# EAGLE design recepteur (EAGLE 6.5.0)
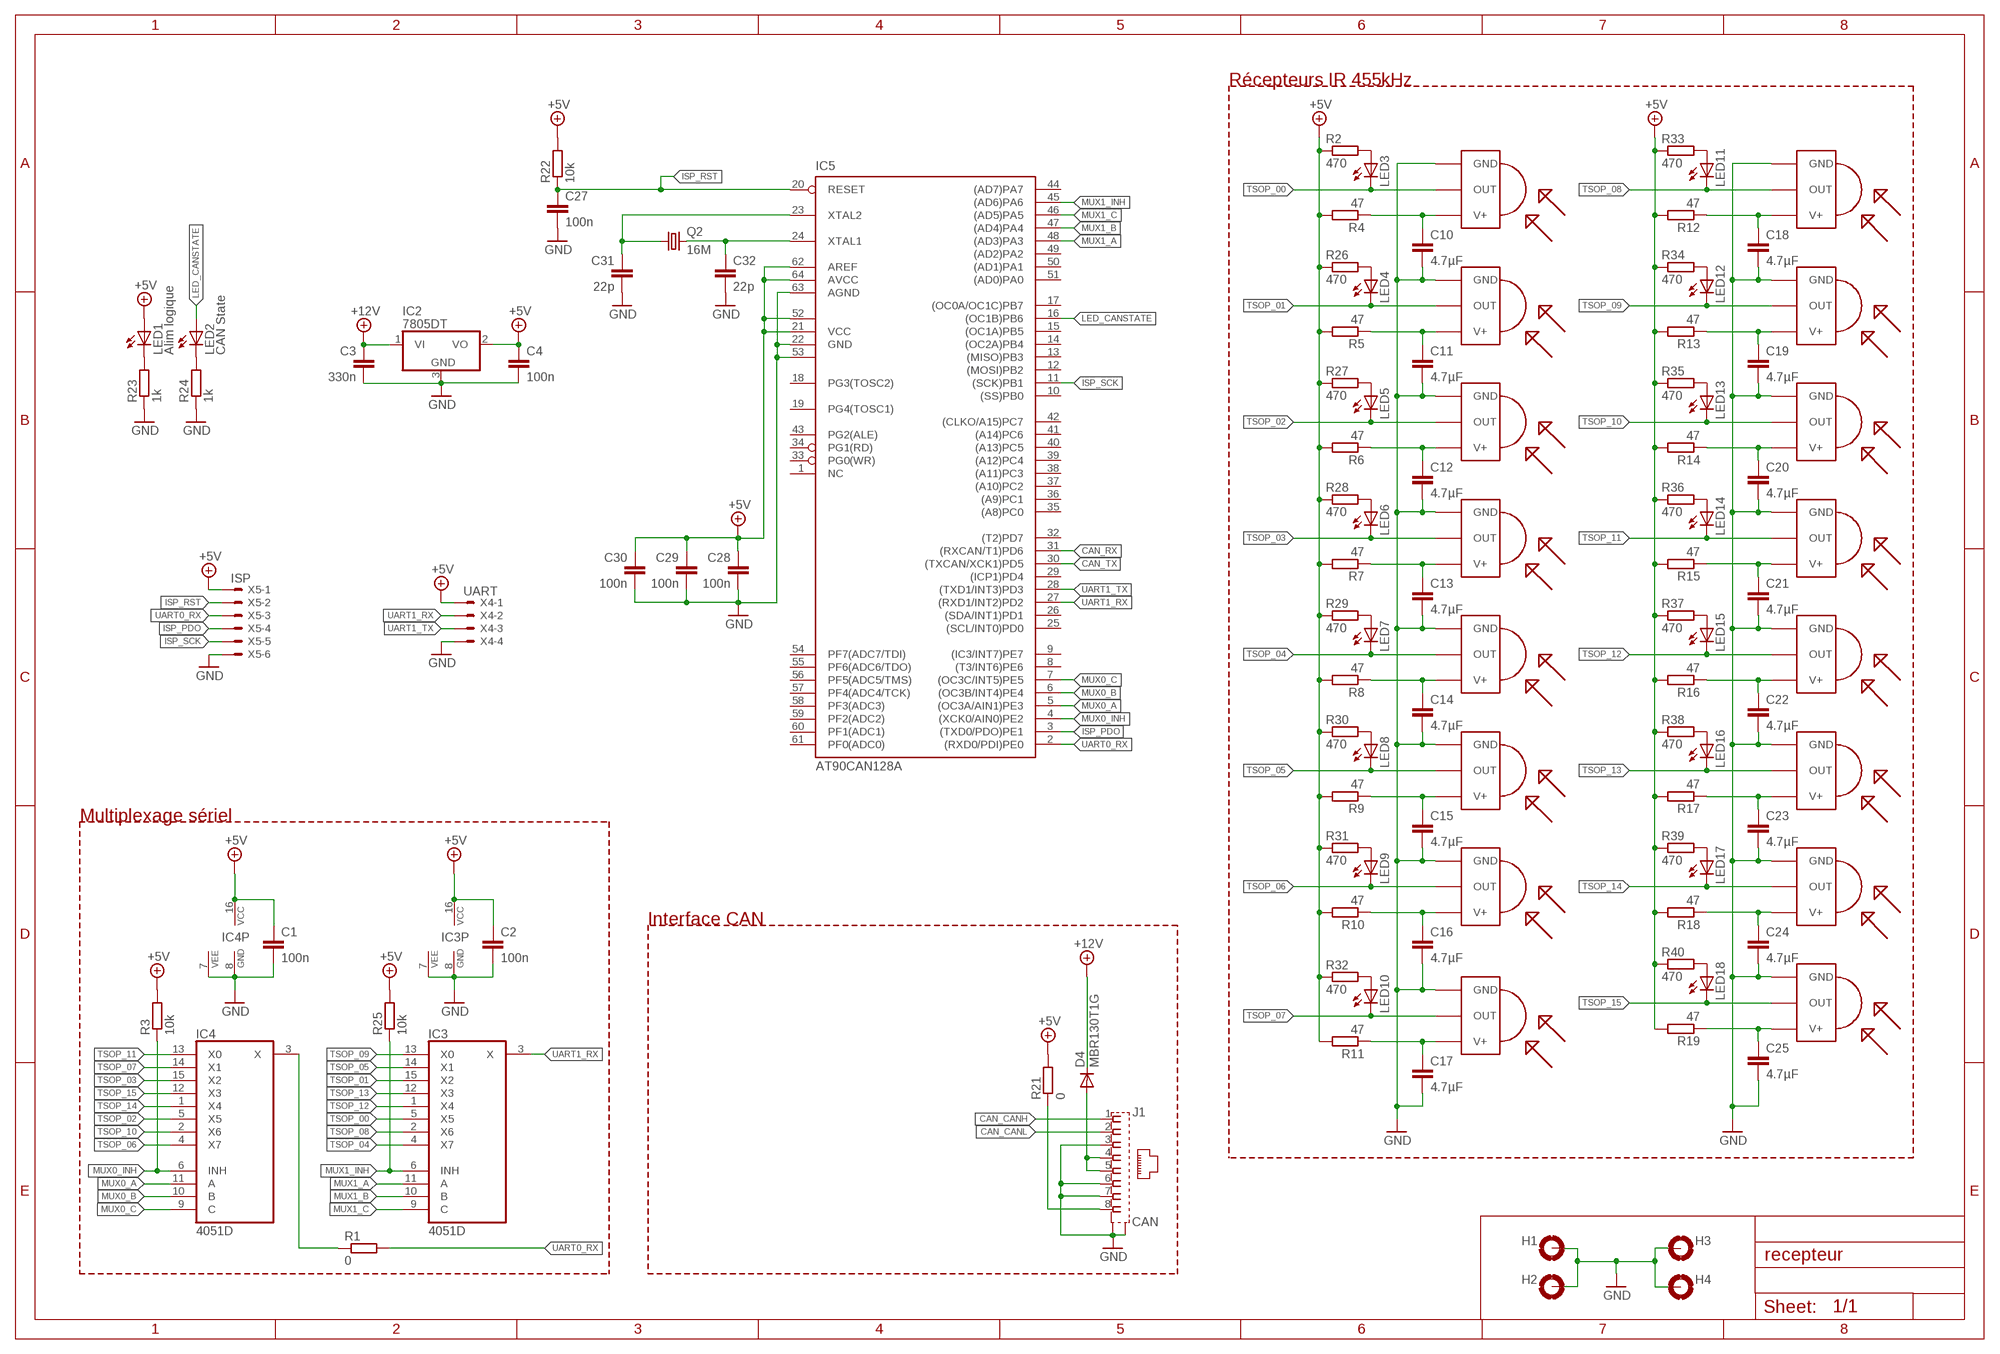
[diagram p0: schematic, sheet 1]

## Parts
C1  100n  C-EUC0805  [C0805]
C2  100n  C-EUC0805  [C0805]
C3  330n  C-EUC0805  [C0805]
C4  100n  C-EUC0805  [C0805]
C10  4.7µF  C-EUC0805  [C0805]
C11  4.7µF  C-EUC0805  [C0805]
C12  4.7µF  C-EUC0805  [C0805]
C13  4.7µF  C-EUC0805  [C0805]
C14  4.7µF  C-EUC0805  [C0805]
C15  4.7µF  C-EUC0805  [C0805]
C16  4.7µF  C-EUC0805  [C0805]
C17  4.7µF  C-EUC0805  [C0805]
C18  4.7µF  C-EUC0805  [C0805]
C19  4.7µF  C-EUC0805  [C0805]
C20  4.7µF  C-EUC0805  [C0805]
C21  4.7µF  C-EUC0805  [C0805]
C22  4.7µF  C-EUC0805  [C0805]
C23  4.7µF  C-EUC0805  [C0805]
C24  4.7µF  C-EUC0805  [C0805]
C25  4.7µF  C-EUC0805  [C0805]
C27  100n  C-EUC0805  [C0805]
C28  100n  C-EUC0805  [C0805]
C29  100n  C-EUC0805  [C0805]
C30  100n  C-EUC0805  [C0805]
C31  22p  C-EUC0805  [C0805]
C32  22p  C-EUC0805  [C0805]
D4  MBR130T1G  DIODE-SOD123  [SOD123]
H1  MOUNT-PAD-ROUND3.0  [3,0-PAD]
H2  MOUNT-PAD-ROUND3.0  [3,0-PAD]
H3  MOUNT-PAD-ROUND3.0  [3,0-PAD]
H4  MOUNT-PAD-ROUND3.0  [3,0-PAD]
IC2  7805DT  [TO252]
IC3  4051D  [SO16]
IC4  4051D  [SO16]
IC5  AT90CAN128A  [TQFP64]
J1  CAN  557969-1  [557969-1]
LED1  Alim logique  LEDCHIP-LED0805  [CHIP-LED0805]
LED2  CAN State  LEDCHIP-LED0805  [CHIP-LED0805]
LED3  LEDCHIP-LED0805  [CHIP-LED0805]
LED4  LEDCHIP-LED0805  [CHIP-LED0805]
LED5  LEDCHIP-LED0805  [CHIP-LED0805]
LED6  LEDCHIP-LED0805  [CHIP-LED0805]
LED7  LEDCHIP-LED0805  [CHIP-LED0805]
LED8  LEDCHIP-LED0805  [CHIP-LED0805]
LED9  LEDCHIP-LED0805  [CHIP-LED0805]
LED10  LEDCHIP-LED0805  [CHIP-LED0805]
LED11  LEDCHIP-LED0805  [CHIP-LED0805]
LED12  LEDCHIP-LED0805  [CHIP-LED0805]
LED13  LEDCHIP-LED0805  [CHIP-LED0805]
LED14  LEDCHIP-LED0805  [CHIP-LED0805]
LED15  LEDCHIP-LED0805  [CHIP-LED0805]
LED16  LEDCHIP-LED0805  [CHIP-LED0805]
LED17  LEDCHIP-LED0805  [CHIP-LED0805]
LED18  LEDCHIP-LED0805  [CHIP-LED0805]
Q2  16M  CRYSTALHC49UP  [HC49UP]
R1  0  R-EU_R0805  [R0805]
R2  470  R-EU_R0805  [R0805]
R3  10k  R-EU_R0805  [R0805]
R4  47  R-EU_R0805  [R0805]
R5  47  R-EU_R0805  [R0805]
R6  47  R-EU_R0805  [R0805]
R7  47  R-EU_R0805  [R0805]
R8  47  R-EU_R0805  [R0805]
R9  47  R-EU_R0805  [R0805]
R10  47  R-EU_R0805  [R0805]
R11  47  R-EU_R0805  [R0805]
R12  47  R-EU_R0805  [R0805]
R13  47  R-EU_R0805  [R0805]
R14  47  R-EU_R0805  [R0805]
R15  47  R-EU_R0805  [R0805]
R16  47  R-EU_R0805  [R0805]
R17  47  R-EU_R0805  [R0805]
R18  47  R-EU_R0805  [R0805]
R19  47  R-EU_R0805  [R0805]
R21  0  R-EU_M0805  [M0805]
R22  10k  R-EU_R0805  [R0805]
R23  1k  R-EU_M0805  [M0805]
R24  1k  R-EU_M0805  [M0805]
R25  10k  R-EU_R0805  [R0805]
R26  470  R-EU_R0805  [R0805]
R27  470  R-EU_R0805  [R0805]
R28  470  R-EU_R0805  [R0805]
R29  470  R-EU_R0805  [R0805]
R30  470  R-EU_R0805  [R0805]
R31  470  R-EU_R0805  [R0805]
R32  470  R-EU_R0805  [R0805]
R33  470  R-EU_R0805  [R0805]
R34  470  R-EU_R0805  [R0805]
R35  470  R-EU_R0805  [R0805]
R36  470  R-EU_R0805  [R0805]
R37  470  R-EU_R0805  [R0805]
R38  470  R-EU_R0805  [R0805]
R39  470  R-EU_R0805  [R0805]
R40  470  R-EU_R0805  [R0805]
TSOP00  TSOP7000  TSOP1830  [TSOP18XX]
TSOP01  TSOP7000  TSOP1830  [TSOP18XX]
TSOP02  TSOP7000  TSOP1830  [TSOP18XX]
TSOP03  TSOP7000  TSOP1830  [TSOP18XX]
TSOP04  TSOP7000  TSOP1830  [TSOP18XX]
TSOP05  TSOP7000  TSOP1830  [TSOP18XX]
TSOP06  TSOP7000  TSOP1830  [TSOP18XX]
TSOP07  TSOP7000  TSOP1830  [TSOP18XX]
TSOP08  TSOP7000  TSOP1830  [TSOP18XX]
TSOP09  TSOP7000  TSOP1830  [TSOP18XX]
TSOP10  TSOP7000  TSOP1830  [TSOP18XX]
TSOP11  TSOP7000  TSOP1830  [TSOP18XX]
TSOP12  TSOP7000  TSOP1830  [TSOP18XX]
TSOP13  TSOP7000  TSOP1830  [TSOP18XX]
TSOP14  TSOP7000  TSOP1830  [TSOP18XX]
TSOP15  TSOP7000  TSOP1830  [TSOP18XX]
X4  UART  53261-04  [53261-04]
X5  ISP  53261-06  [53261-06]

## Nets
+5V: C1.1 C2.1 C4.1 C28.1 C29.1 C30.1 IC2.2(VO) IC3.16(VCC) IC4.16(VCC) IC5.21(VCC) IC5.52(VCC1) IC5.62(AREF) IC5.64(AVCC) LED1.A R2.1 R3.2 R4.2 R5.2 R6.2 R7.2 R8.2 R9.2 R10.2 R11.2 R12.2 R13.2 R14.2 R15.2 R16.2 R17.2 R18.2 R19.2 R21.2 R22.2 R25.2 R26.1 R27.1 R28.1 R29.1 R30.1 R31.1 R32.1 R33.1 R34.1 R35.1 R36.1 R37.1 R38.1 R39.1 R40.1 X4.1 X5.1
+12V: C3.1 D4.C IC2.1(VI)
CAN_CANH: J1.1
CAN_CANL: J1.2
CAN_RX: IC5.31((RXCAN/T1)PD6)
CAN_TX: IC5.30((TXCAN/XCK1)PD5)
GND: C1.2 C2.2 C3.2 C4.2 C10.2 C11.2 C12.2 C13.2 C14.2 C15.2 C16.2 C17.2 C18.2 C19.2 C20.2 C21.2 C22.2 C23.2 C24.2 C25.2 C27.2 C28.2 C29.2 C30.2 C31.2 C32.2 H1.B3,0(MOUNT) H2.B3,0(MOUNT) H3.B3,0(MOUNT) H4.B3,0(MOUNT) IC2.3(GND) IC3.7(VEE) IC3.8(GND) IC4.7(VEE) IC4.8(GND) IC5.22(GND) IC5.53(GND1) IC5.63(AGND) J1.3 J1.6 J1.7 J1.G1(S2) J1.G2(S1) R23.1 R24.1 TSOP00.GND TSOP01.GND TSOP02.GND TSOP03.GND TSOP04.GND TSOP05.GND TSOP06.GND TSOP07.GND TSOP08.GND TSOP09.GND TSOP10.GND TSOP11.GND TSOP12.GND TSOP13.GND TSOP14.GND TSOP15.GND X4.4 X5.6
ISP_PDO: IC5.3((TXD0/PDO)PE1) X5.4
ISP_RST: C27.1 IC5.20(RESET) R22.1 X5.2
ISP_SCK: IC5.11((SCK)PB1) X5.5
LED_CANSTATE: IC5.16((OC1B)PB6) LED2.A
MUX0_A: IC4.11(A) IC5.5((OC3A/AIN1)PE3)
MUX0_B: IC4.10(B) IC5.6((OC3B/INT4)PE4)
MUX0_C: IC4.9(C) IC5.7((OC3C/INT5)PE5)
MUX0_INH: IC4.6(INH) IC5.4((XCK0/AIN0)PE2) R3.1
MUX1_A: IC3.11(A) IC5.48((AD3)PA3)
MUX1_B: IC3.10(B) IC5.47((AD4)PA4)
MUX1_C: IC3.9(C) IC5.46((AD5)PA5)
MUX1_INH: IC3.6(INH) IC5.45((AD6)PA6) R25.1
N$1: IC4.3(X) R1.1
N$2: LED3.A R2.2
N$3: LED4.A R26.2
N$4: LED5.A R27.2
N$6: LED6.A R28.2
N$7: LED7.A R29.2
N$8: J1.8 R21.1
N$9: C10.1 R4.1 TSOP00.VCC(V+)
N$10: C11.1 R5.1 TSOP01.VCC(V+)
N$11: C12.1 R6.1 TSOP02.VCC(V+)
N$12: C13.1 R7.1 TSOP03.VCC(V+)
N$13: C32.1 IC5.24(XTAL1) Q2.2
N$14: C31.1 IC5.23(XTAL2) Q2.1
N$15: LED1.C R23.2
N$16: LED8.A R30.2
N$17: LED2.C R24.2
N$18: LED9.A R31.2
N$19: LED10.A R32.2
N$20: LED11.A R33.2
N$21: C14.1 R8.1 TSOP04.VCC(V+)
N$22: C15.1 R9.1 TSOP05.VCC(V+)
N$23: C16.1 R10.1 TSOP06.VCC(V+)
N$24: LED12.A R34.2
N$26: LED13.A R35.2
N$27: LED14.A R36.2
N$28: LED15.A R37.2
N$29: LED16.A R38.2
N$30: LED17.A R39.2
N$31: LED18.A R40.2
N$32: C17.1 R11.1 TSOP07.VCC(V+)
N$33: C25.1 R19.1 TSOP15.VCC(V+)
N$34: D4.A J1.4 J1.5
N$35: C24.1 R18.1 TSOP14.VCC(V+)
N$36: C23.1 R17.1 TSOP13.VCC(V+)
N$37: C22.1 R16.1 TSOP12.VCC(V+)
N$38: C21.1 R15.1 TSOP11.VCC(V+)
N$39: C19.1 R13.1 TSOP09.VCC(V+)
N$40: C20.1 R14.1 TSOP10.VCC(V+)
N$41: C18.1 R12.1 TSOP08.VCC(V+)
TSOP_00: IC3.5(X5) LED3.C TSOP00.OUT
TSOP_01: IC3.15(X2) LED4.C TSOP01.OUT
TSOP_02: IC4.5(X5) LED5.C TSOP02.OUT
TSOP_03: IC4.15(X2) LED6.C TSOP03.OUT
TSOP_04: IC3.4(X7) LED7.C TSOP04.OUT
TSOP_05: IC3.14(X1) LED8.C TSOP05.OUT
TSOP_06: IC4.4(X7) LED9.C TSOP06.OUT
TSOP_07: IC4.14(X1) LED10.C TSOP07.OUT
TSOP_08: IC3.2(X6) LED11.C TSOP08.OUT
TSOP_09: IC3.13(X0) LED12.C TSOP09.OUT
TSOP_10: IC4.2(X6) LED13.C TSOP10.OUT
TSOP_11: IC4.13(X0) LED14.C TSOP11.OUT
TSOP_12: IC3.1(X4) LED15.C TSOP12.OUT
TSOP_13: IC3.12(X3) LED16.C TSOP13.OUT
TSOP_14: IC4.1(X4) LED17.C TSOP14.OUT
TSOP_15: IC4.12(X3) LED18.C TSOP15.OUT
UART0_RX: IC5.2((RXD0/PDI)PE0) R1.2 X5.3
UART1_RX: IC3.3(X) IC5.27((RXD1/INT2)PD2) X4.2
UART1_TX: IC5.28((TXD1/INT3)PD3) X4.3
Unconnected: IC5.1(NC) IC5.8((T3/INT6)PE6) IC5.9((IC3/INT7)PE7) IC5.10((SS)PB0) IC5.12((MOSI)PB2) IC5.13((MISO)PB3) IC5.14((OC2A)PB4) IC5.15((OC1A)PB5) IC5.17((OC0A/OC1C)PB7) IC5.18(PG3(TOSC2)) IC5.19(PG4(TOSC1)) IC5.25((SCL/INT0)PD0) IC5.26((SDA/INT1)PD1) IC5.29((ICP1)PD4) IC5.32((T2)PD7) IC5.33(PG0(WR)) IC5.34(PG1(RD)) IC5.35((A8)PC0) IC5.36((A9)PC1) IC5.37((A10)PC2) IC5.38((A11)PC3) IC5.39((A12)PC4) IC5.40((A13)PC5) IC5.41((A14)PC6) IC5.42((CLKO/A15)PC7) IC5.43(PG2(ALE)) IC5.44((AD7)PA7) IC5.49((AD2)PA2) IC5.50((AD1)PA1) IC5.51((AD0)PA0) IC5.54(PF7(ADC7/TDI)) IC5.55(PF6(ADC6/TDO)) IC5.56(PF5(ADC5/TMS)) IC5.57(PF4(ADC4/TCK)) IC5.58(PF3(ADC3)) IC5.59(PF2(ADC2)) IC5.60(PF1(ADC1)) IC5.61(PF0(ADC0))

## Notes on the sheet
- Récepteurs IR 455kHz
- Multiplexage sériel
- Interface CAN

## Library data of the parts
C1-C4 C10-C25 C27-C32 = rcl:C-EU: CAPACITOR, European symbol
D4 = diode:DIODE-: DIODE
H1-H4 = holes:MOUNT-PAD-ROUND: MOUNTING PAD, round
IC2 = linear:78*: Positive VOLTAGE REGULATOR Source: http://cache.national.com/ds/LM/LM78L05.pdf http://www.fairchildsemi.com/ds/LM/LM7805.pdf
IC3 IC4 = 40xx:4051: 8-channel ANALOG MULTIPLEXER
IC5 = avr:AT90CAN128: MICROCONTROLLER 128 Kbytes FLASH 4 Kbytes SRAM 4 Kbytes EEPROM DUAL USART 8-channel 10 bit ADC CAN 2.0 A&B Interface
J1 = con-amp:557969-1: AMP connector
LED1-LED18 = led:LED: LED OSRAM: - CHIPLED LG R971, LG N971, LY N971, LG Q971, LY Q971, LO R971, LY R971 LH N974, LH R974 LS Q976, LO Q976, LY Q976 LO Q996 - Hyper CHIPLED LW Q18S LB Q993, LB Q99A, LB R99A - SideLED LS A670, LO A670, LY A670, LG A670, LP A670 LB A673, LV A673, LT A673, LW A673 LH A674 LY A675 LS A676, LA A676, LO A676, LY A676, LW A676 LS A679, LY A679, LG A679 - Hyper Micro SIDELED® LS Y876, LA Y876, LO Y876, LY Y876 LT Y87S - SmartLED LW L88C, LW L88S LB L89C, LB L89S, LG L890 LS L89K, LO L89K, LY L89K LS L896, LA L896, LO L896, LY L896 - TOPLED LS T670, LO T670, LY T670, LG T670, LP T670 LSG T670, LSP T670, LSY T670, LOP T670, LYG T670 LG T671, LOG T671, LSG T671 LB T673, LV T673, LT T673, LW T673 LH T674 LS T676, LA T676, LO T676, LY T676, LB T676, LH T676, LSB T676, LW T676 LB T67C, LV T67C, LT T67C, LS T67K, LO T67K, LY T67K, LW E67C LS E67B, LA E67B, LO E67B, LY E67B, LB E67C, LV E67C, LT E67C LW T67C LS T679, LY T679, LG T679 LS T770, LO T770, LY T770, LG T770, LP T770 LB T773, LV T773, LT T773, LW T773 LH T774 LS E675, LA E675, LY E675, LS T675 LS T776, LA T776, LO T776, LY T776, LB T776 LHGB T686 LT T68C, LB T68C - Hyper Mini TOPLED® LB M676 - Mini TOPLED Santana® LG M470 LS M47K, LO M47K, LY M47K Source: http://www.osram.convergy.de - LUMILED® LXK2-PW12-R00, LXK2-PW12-S00, LXK2-PW14-U00, LXK2-PW14-V00 LXK2-PM12-R00, LXK2-PM12-S00, LXK2-PM14-U00 LXK2-PE12-Q00, LXK2-PE12-R00, LXK2-PE12-S00, LXK2-PE14-T00, LXK2-PE14-U00 LXK2-PB12-K00, LXK2-PB12-L00, LXK2-PB12-M00, LXK2-PB14-N00, LXK2-PB14-P00, LXK2-PB14-Q00 LXK2-PR12-L00, LXK2-PR12-M00, LXK2-PR14-Q00, LXK2-PR14-R00 LXK2-PD12-Q00, LXK2-PD12-R00, LXK2-PD12-S00 LXK2-PH12-R00, LXK2-PH12-S00 LXK2-PL12-P00, LXK2-PL12-Q00, LXK2-PL12-R00 Source: www.luxeon.com
Q2 = crystal:CRYSTAL: CRYSTAL
R1-R19 R21-R40 = rcl:R-EU_: RESISTOR, European symbol
TSOP00 TSOP01-TSOP09 TSOP10-TSOP15 = tsop:TSOP1830: IR Receiver and Demodulator
X4 = con-molex:53?-04: CONNECTOR wire to board 1.25 mm (.049 inch) pitch header
X5 = con-molex:53?-06: CONNECTOR wire to board 1.25 mm (.049 inch) pitch header

## Board
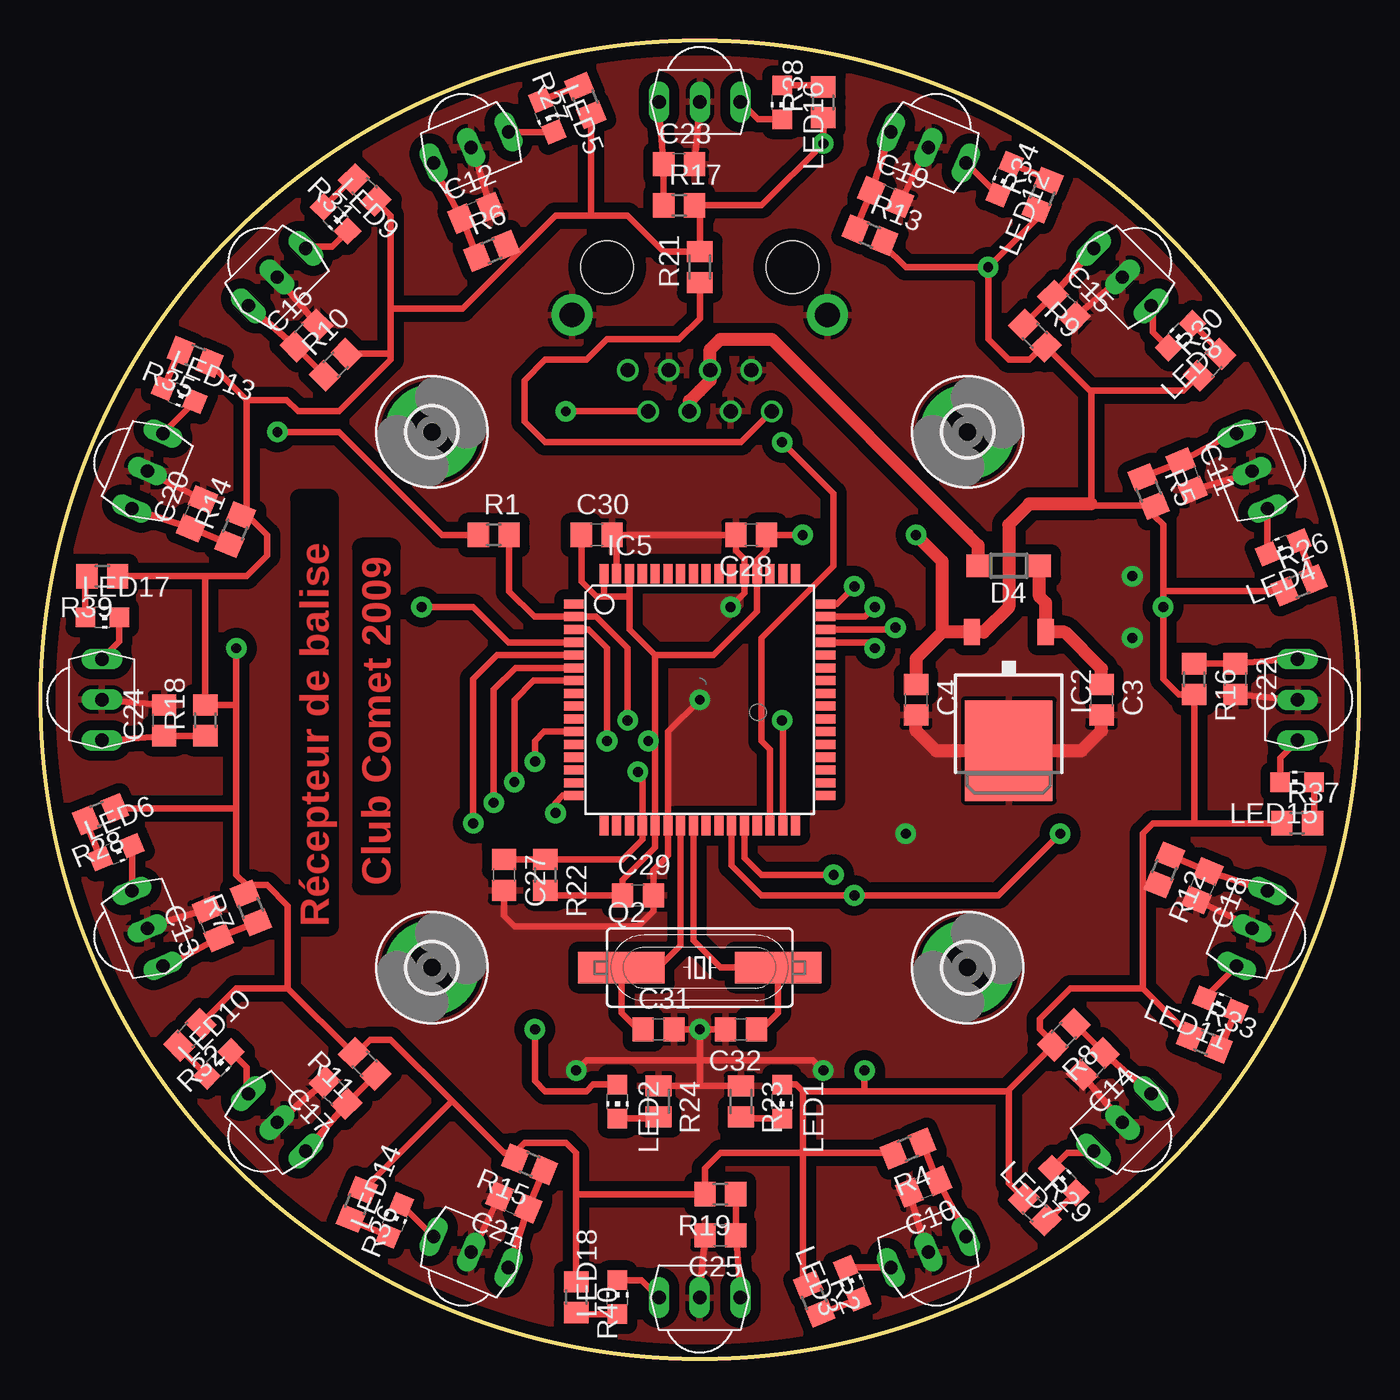
[diagram p1: board, top side]
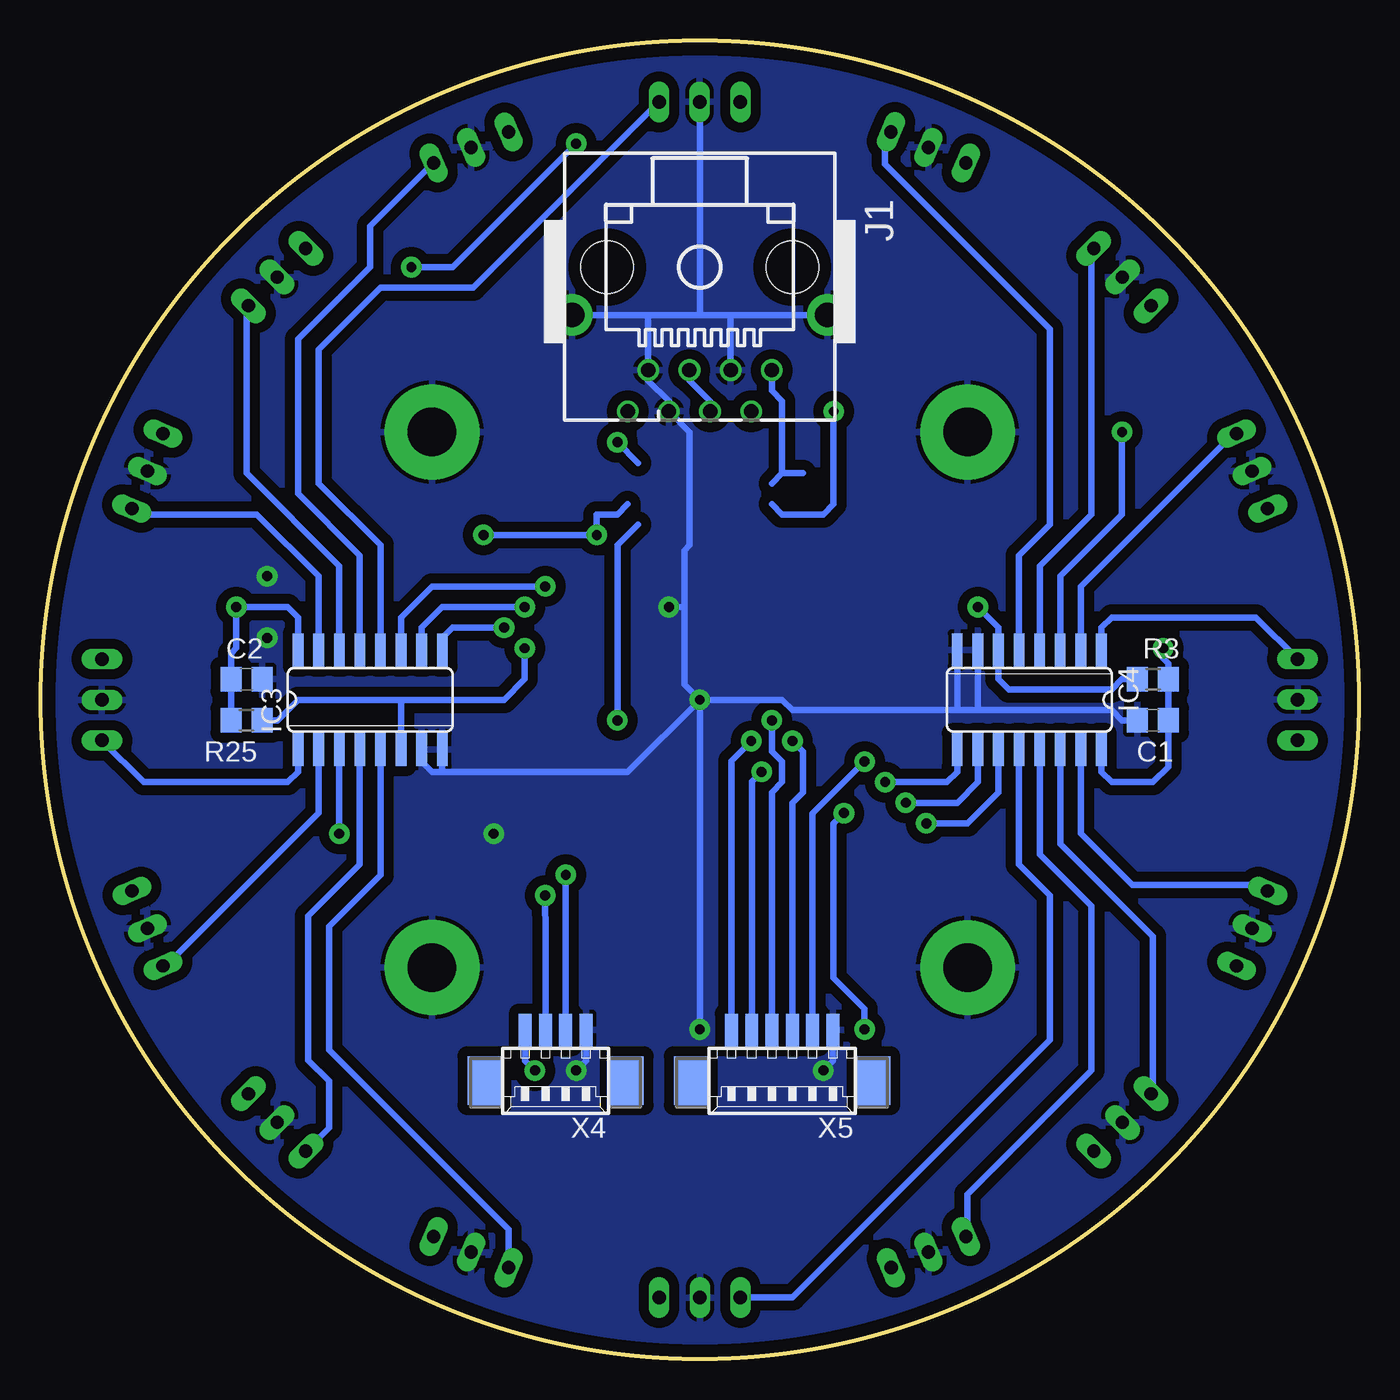
[diagram p2: board, bottom side, seen from below]

Size 81.28 x 81.28 mm. Coordinates in mm from the lower left corner, seen from the top.
Outline: circle at 40.64,40.64 radius 40.64
Copper layers (1*16): Top 0.035mm / dielectric 1.5mm / Bottom 0.035mm
Design rules "The PCB Shop": minimum track width 0.2mm, minimum drill 0.35mm, track to track 0.2mm, track to pad 0.2mm, pad to pad 0.2mm, via to via 0.2mm, smd to smd 0.2mm, copper to edge 30mil, drill to drill 10mil, minimum pad ring 0.225mm, minimum via ring 0.225mm, stop-mask expansion 0mil, vias tented up to drill 0mil, thermal gap 10mil

### Footprints (pad centres in the part's own frame; a part is rotated, then mirrored left to right if it is on the bottom)
C0805 = smd 1.3 x 1.5: 1 -0.95,0; 2 0.95,0
SOD123 = smd 1.4 x 1.4: A 1.9,0; C -1.9,0
3,0-PAD = drill 3 pad 5.842: B3,0 0,0
TO252 = smd 1 x 1.6: 1 -2.28,-4.8; 2 2.28,-4.8 | smd 5.4 x 6.2: 3 0,2.5
SO16 = smd 0.66 x 2.032: 1 -4.445,-3.073; 2 -3.175,-3.073; 3 -1.905,-3.073; 4 -0.635,-3.073; 5 0.635,-3.073; 6 1.905,-3.073; 7 3.175,-3.073; 8 4.445,-3.073; 9 4.445,3.073; 10 3.175,3.073; 11 1.905,3.073; 12 0.635,3.073; 13 -0.635,3.073; 14 -1.905,3.073; 15 -3.175,3.073; 16 -4.445,3.073
TQFP64 = smd 1.194 x 0.559: 1 -7.76,5.905; 2 -7.76,5.118; 3 -7.76,4.331; 4 -7.76,3.543; 5 -7.76,2.756; 6 -7.76,1.968; 7 -7.76,1.181; 8 -7.76,0.394; 9 -7.76,-0.394; 10 -7.76,-1.181; 11 -7.76,-1.968; 12 -7.76,-2.756; 13 -7.76,-3.543; 14 -7.76,-4.331; 15 -7.76,-5.118; 16 -7.76,-5.905; 33 7.76,-5.905; 34 7.76,-5.118; 35 7.76,-4.331; 36 7.76,-3.543; 37 7.76,-2.756; 38 7.76,-1.968; 39 7.76,-1.181; 40 7.76,-0.394; 41 7.76,0.394; 42 7.76,1.181; 43 7.76,1.968; 44 7.76,2.756; 45 7.76,3.543; 46 7.76,4.331; 47 7.76,5.118; 48 7.76,5.905 | smd 0.559 x 1.194: 17 -5.905,-7.76; 18 -5.118,-7.76; 19 -4.331,-7.76; 20 -3.543,-7.76; 21 -2.756,-7.76; 22 -1.968,-7.76; 23 -1.181,-7.76; 24 -0.394,-7.76; 25 0.394,-7.76; 26 1.181,-7.76; 27 1.968,-7.76; 28 2.756,-7.76; 29 3.543,-7.76; 30 4.331,-7.76; 31 5.118,-7.76; 32 5.905,-7.76; 49 5.905,7.76; 50 5.118,7.76; 51 4.331,7.76; 52 3.543,7.76; 53 2.756,7.76; 54 1.968,7.76; 55 1.181,7.76; 56 0.394,7.76; 57 -0.394,7.76; 58 -1.181,7.76; 59 -1.968,7.76; 60 -2.756,7.76; 61 -3.543,7.76; 62 -4.331,7.76; 63 -5.118,7.76; 64 -5.905,7.76
557969-1 = drill 0.889: 1 -4.445,6.35; 2 -3.175,8.89; 3 -1.905,6.35; 4 -0.635,8.89; 5 0.635,6.35; 6 1.905,8.89; 7 3.175,6.35; 8 4.445,8.89 | drill 1.524 pad 2.54: G1 -7.874,2.946; G2 7.874,2.946 | hole 3.251: -5.715,0; 5.715,0
CHIP-LED0805 = smd 1.2 x 1.2: A 0,-1.05; C 0,1.05
HC49UP = smd 5.334 x 1.93: 1 -4.826,0; 2 4.826,0
R0805 = smd 1.3 x 1.5: 1 -0.95,0; 2 0.95,0
M0805 = smd 1.3 x 1.6: 1 -0.95,0; 2 0.95,0
TSOP18XX = drill 0.813 long: GND -0.001,-0.027; OUT -2.501,-0.027; VCC 2.499,-0.027
53261-04 = smd 0.8 x 2: 1 1.875,-2.5; 2 0.625,-2.5; 3 -0.625,-2.5; 4 -1.875,-2.5 | smd 2.1 x 3: S1 4.375,0.625; S2 -4.375,0.625
53261-06 = smd 0.8 x 2: 1 3.125,-2.5; 2 1.875,-2.5; 3 0.625,-2.5; 4 -0.625,-2.5; 5 -1.875,-2.5; 6 -3.125,-2.5 | smd 2.1 x 3: S1 5.625,0.625; S2 -5.625,0.625

### Placement (x,y rotation side)
C1  12.7,39.37 180 bottom
C2  68.58,41.91 0 bottom
C3  65.41,40.64 270 top
C4  53.98,40.64 270 top
C10  54.45,10.62 202.5 top
C11  70.66,54.45 292.5 top
C12  26.83,70.66 22.5 top
C13  10.62,26.83 112.5 top
C14  64.89,18.19 225 top
C15  63.09,64.89 315 top
C16  16.39,63.09 45 top
C17  18.19,16.39 135 top
C18  71.63,29.18 247.5 top
C19  52.1,71.63 337.5 top
C20  9.65,52.1 67.5 top
C21  29.18,9.65 157.5 top
C22  73.66,41.91 270 top
C23  39.37,73.66 0 top
C24  7.62,39.37 90 top
C25  41.91,7.62 180 top
C27  28.57,29.84 270 top
C28  43.82,50.8 180 top
C29  36.83,28.57 0 top
C30  34.29,50.8 0 top
C31  38.1,20.32 0 top
C32  43.18,20.32 180 top
D4  59.69,48.9 180 top
H1  57.15,24.13 0 top
H2  24.13,24.13 0 top
H3  57.15,57.15 0 top
H4  24.13,57.15 0 top
IC2  59.69,40.01 180 top
IC3  60.96,40.64 0 bottom
IC4  20.32,40.64 180 bottom
IC5  40.64,40.64 0 top
J1  40.64,67.31 180 bottom
LED1  45.72,15.88 180 top
LED2  35.56,15.88 180 top
LED3  50.04,4.67 22.5 top
LED4  76.61,50.04 112.5 top
LED5  31.24,76.61 202.5 top
LED6  4.67,31.24 292.5 top
LED7  63.09,11.01 45 top
LED8  70.27,63.09 135 top
LED9  18.19,70.27 225 top
LED10  11.01,18.19 315 top
LED11  72.72,21.85 67.5 top
LED12  59.43,72.72 157.5 top
LED13  8.56,59.43 247.5 top
LED14  21.85,8.56 337.5 top
LED15  77.47,35.56 90 top
LED16  45.72,77.47 180 top
LED17  3.81,45.72 270 top
LED18  35.56,3.81 0 top
Q2  40.64,24.13 0 top
R1  27.94,50.8 0 top
R2  47.69,3.7 292.5 top
R3  12.7,41.91 0 bottom
R4  53.48,12.97 202.5 top
R5  68.31,53.48 292.5 top
R6  27.8,68.31 22.5 top
R7  12.97,27.8 112.5 top
R8  63.09,19.99 225 top
R9  61.29,63.09 315 top
R10  18.19,61.29 45 top
R11  19.99,18.19 135 top
R12  69.29,30.15 247.5 top
R13  51.13,69.29 337.5 top
R14  11.99,51.13 67.5 top
R15  30.15,11.99 157.5 top
R16  71.12,41.91 270 top
R17  39.37,71.12 0 top
R18  10.16,39.37 90 top
R19  41.91,10.16 180 top
R21  40.64,67.31 90 top
R22  31.11,29.84 270 top
R23  43.18,15.88 270 top
R24  38.1,15.88 270 top
R25  68.58,39.37 180 bottom
R26  77.58,47.69 22.5 top
R27  33.59,77.58 112.5 top
R28  3.7,33.59 202.5 top
R29  61.29,9.21 315 top
R30  72.07,61.29 45 top
R31  19.99,72.07 135 top
R32  9.21,19.99 225 top
R33  71.75,19.51 337.5 top
R34  61.77,71.75 67.5 top
R35  9.53,61.77 157.5 top
R36  19.51,9.53 247.5 top
R37  77.47,33.02 0 top
R38  48.26,77.47 90 top
R39  3.81,48.26 180 top
R40  33.02,3.81 270 top
TSOP00  54.73,6.61 22.5 top
TSOP01  74.67,54.73 112.5 top
TSOP02  26.55,74.67 202.5 top
TSOP03  6.61,26.55 292.5 top
TSOP04  66.68,14.6 45 top
TSOP05  66.68,66.68 135 top
TSOP06  14.6,66.68 225 top
TSOP07  14.6,14.6 315 top
TSOP08  74.67,26.55 67.5 top
TSOP09  54.73,74.67 157.5 top
TSOP10  6.61,54.73 247.5 top
TSOP11  26.55,6.61 337.5 top
TSOP12  77.47,40.64 90 top
TSOP13  40.64,77.47 180 top
TSOP14  3.81,40.64 270 top
TSOP15  40.64,3.81 0 top
X4  49.53,17.78 180 bottom
X5  35.56,17.78 180 bottom

### Tracks (layer width: path | path; a pad name or v marks a point on that pad's centre or on a via)
+5V  (via drill 0.61 pad 1.27)
  Top 0.406: R40.1 33.02,6.35 33.02,10.16 | 33.02,10.16 R19.2 40.96,11.75 41.91,12.7 46.99,12.7 | v48.26,74.93 44.45,71.12 40.64,71.12 | v48.26,74.93 | 71.12,33.02 71.12,36.83 R16.2 70.17,40.96 69.22,41.91 v69.22,46.35 69.22,48.9 | 71.12,33.02 R37.1 | 10.16,48.26 10.16,44.45 R18.2 12.06,40.32 12.06,39.37 | 5.08,48.26 | 5.08,48.26 R39.1 | 10.16,48.26 5.08,48.26 | 36.31,46.99 IC5.62 | 36.31,46.99 34.92,46.99 | C30.1 33.34,47.94 34.29,46.99 34.92,46.99 | IC5.64 34.73,46.99 34.92,46.99 | 31.11,28.57 R22.2 | 31.11,28.57 C29.1 35.88,29.53 37.88,31.53 IC5.21 37.88,38.1 | 31.11,28.57 | 21.59,64.75 21.59,64.69 | R32.1 10.18,20.95 10.79,21.59 12.06,22.86 15.24,22.86 | R30.1 70.47,59.69 64.77,59.69 | 64.77,59.69 64.69,59.69 R9.2 61.78,62.42 60.96,61.59 59.69,61.59 58.42,62.87 v58.42,67.31 | 12.6,29.21 R7.2 | 12.6,29.21 12.6,29.31 | 12.7,59.12 R35.1 | 12.7,59.12 12.7,52.35 R14.2 12.76,52.01 13.97,50.8 13.97,49.53 12.7,48.26 10.16,48.26 | 40.64,71.12 R17.2 | 40.64,71.12 R21.2 38.42,68.26 36.2,70.48 34.29,70.48 | 37.88,38.1 v37.47,38.1 | LED1.A 46.58,16.93 46.99,16.51 | 46.99,16.51 50.8,16.51 | 50.8,16.51 v50.8,17.78 | 36.31,46.99 36.31,44.97 37.88,43.4 | 37.88,43.4 37.88,38.1 | 37.88,43.4 41.49,43.4 44.18,46.09 IC5.52 44.18,49.26 44.77,49.84 C28.1 v46.99,50.8 | 34.29,70.48 31.75,70.48 29.21,67.94 | R27.1 33.95,70.48 34.29,70.48 | 12.06,33.95 R28.1 | 12.06,33.95 12.06,39.37 | 12.7,29.21 12.6,29.21 | 12.06,33.95 12.06,29.84 12.7,29.21 | 15.24,22.86 19.24,18.86 R11.2 19.5,18.86 20.32,19.68 21.59,19.68 25.4,15.88 | 15.24,22.86 15.24,27.94 13.97,29.21 12.7,29.21 | 25.4,15.88 28.57,12.7 28.93,12.7 R15.2 29.27,12.76 29.84,13.34 32.38,13.34 33.02,12.7 33.02,10.16
  Top 0.406: R36.1 25.34,15.88 25.4,15.88 | 46.99,12.7 46.99,16.51 | R2.1 47.12,4.58 46.99,4.45 46.99,12.7 | R4.2 52.7,12.7 46.99,12.7 | 50.8,16.51 59.69,16.51 | R29.1 59.69,10.81 59.69,16.51 | 59.69,16.51 59.69,16.59 R8.2 62.42,19.5 61.59,20.32 61.59,20.95 63.5,22.86 67.94,22.86 | R33.1 70.87,19.93 67.94,22.86 | R34.1 61.41,70.3 v58.42,67.31 | R13.2 52.01,68.64 53.34,67.31 v58.42,67.31 | 64.77,59.69 64.77,52.7 64.88,52.6 R5.2 68.68,51.97 69.22,51.44 69.22,48.9 | R26.1 69.22,47.33 69.22,48.9 | 71.12,33.02 68.58,33.02 67.94,32.38 67.94,29.84 | 67.94,22.86 67.94,29.84 | R12.2 67.94,29.27 67.94,29.84 | 12.7,59.12 15.18,59.12 15.88,58.42 18.41,58.42 21.59,61.59 21.59,62.23 | 21.59,62.23 21.59,64.75 | R10.2 21.59,61.97 21.59,62.23 | 21.59,64.75 26.02,64.75 29.21,67.94 | R6.2 28.68,68.47 29.21,67.94 | R31.1 20.68,71.4 21.59,70.48 21.59,64.75 | R38.1 | v48.26,74.93 R38.1 | 12.06,39.37 v12.06,43.81
  Top 0.813: 55.6,44.8 IC2.2 58.14,44.8 59.69,46.35 59.69,51.44 60.96,52.7 64.77,52.7 | 55.6,44.8 53.98,43.18 C4.1 | 55.6,44.8 55.6,49.17 v53.98,50.8
  Bottom 0.406: 45.09,52.7 45.72,52.07 46.99,52.07 v46.99,50.8 v53.98,50.8 | IC4.16 15.88,36.2 15.24,35.56 12.7,35.56 11.75,36.51 C1.1 11.43,39.37 11.75,39.69 R3.2 11.75,42.87 12.06,43.18 v12.06,43.81 | X5.1 38.69,36.88 v37.47,38.1 | X4.1 51.41,18.39 v50.8,17.78 | IC3.16 65.41,45.72 66.04,46.35 v69.22,46.35 69.22,43.81 69.53,43.5 C2.1 69.85,41.91 69.53,41.59 R25.2 | v48.26,74.93 55.88,67.31 v58.42,67.31
+12V
  Top 0.813: C3.1 65.41,42.55 63.15,44.8 IC2.1 61.97,46.62 61.59,46.99 D4.C
CAN_CANH
  Bottom 0.406: 35.56,54.61 36.2,53.98 | 34.29,54.61 35.56,54.61 | 35.56,54.61 35.56,59.05 36.2,59.69 J1.1
CAN_CANL  (via drill 0.61 pad 1.27)
  Top 0.406: v32.38,58.42 J1.2
  Bottom 0.406: 35.56,52.07 34.29,52.07 | 35.56,52.07 36.2,52.7 | 35.56,52.07 33.02,52.07 32.38,52.7 v32.38,58.42
CAN_RX  (via drill 0.61 pad 1.27)
  Top 0.406: IC5.31 45.76,39.33 v45.72,39.37
  Bottom 0.406: v45.72,39.37 45.72,50.16 44.45,51.44
CAN_TX  (via drill 0.61 pad 1.27)
  Top 0.406: IC5.30 44.97,37.58 44.45,38.1 44.45,44.45 48.9,48.9 48.9,53.34 v45.72,56.52
  Bottom 0.406: v45.72,56.52 44.45,55.24
GND  (via drill 0.61 pad 1.27)
  Top 0.406: 35.56,50.8 C30.2 | IC5.63 35.52,50.76 35.56,50.8 | 39.37,20.32 | 39.37,20.32 C31.2 | v40.64,20.32 39.37,20.32 | v40.64,20.32 C32.2 | 40.64,16.82 R24.1 | 40.64,16.82 R23.1 | 40.64,18.41 40.64,16.82 | 40.64,18.41 v40.64,20.32 | 35.56,50.8 C28.2 42.87,49.84 43.4,49.31 IC5.53 43.4,47.21 v42.55,46.35 | TSOP09.GND 54.61,74.61 C19.2 | TSOP01.GND 74.61,54.61 C11.2 | TSOP08.GND 74.61,26.67 C18.2 | TSOP00.GND 54.61,6.67 C10.2 | TSOP11.GND 26.67,6.67 C21.2 | TSOP03.GND 6.67,26.67 C13.2 | TSOP10.GND 6.67,54.61 C20.2 | TSOP02.GND 26.67,74.61 C12.2 | TSOP13.GND 40.64,77.47 C23.2 | TSOP05.GND 66.67,66.67 C15.2 | TSOP12.GND 77.47,40.64 C22.2 | TSOP04.GND 66.67,14.61 C14.2 | TSOP15.GND 40.64,4.13 C25.2 | TSOP07.GND 14.61,14.61 C17.2 | TSOP14.GND 3.81,40.64 C24.2 | TSOP06.GND 14.61,66.67 C16.2 | v40.64,40.64 38.67,38.67 IC5.22 38.67,31.05 37.78,30.16 C29.2 37.78,27.62 36.83,26.67 29.21,26.67 28.57,27.3 C27.2 | v33.02,17.78 33.66,18.41 40.64,18.41 | v48.26,17.78 47.62,18.41 40.64,18.41
  Top 0.813: C4.2 53.98,38.73 55.2,37.51 IC2.3 64.17,37.51 65.41,38.73 C3.2
  Bottom 0.406: C1.2 14.61,39.37 15.24,40.01 23.5,40.01 | 24.77,40.01 23.5,40.01 | 23.5,40.01 IC4.7 | 43.81,64.36 J1.G2 | 38.73,64.36 J1.G1 | 43.81,64.36 38.73,64.36 | 43.81,64.36 J1.7 43.81,60.33 42.55,59.05 J1.6 41.27,57.15 41.27,53.98 41.27,50.16 41.59,49.85 41.59,46.35 | 38.73,64.36 J1.3 | 41.59,46.35 41.59,41.59 v40.64,40.64 | X5.6 32.44,18.36 v33.02,17.78 | X4.4 47.66,18.39 v48.26,17.78 | TSOP13.GND 40.64,64.36 38.73,64.36 | 24.77,40.01 IC4.8 | 24.77,40.01 34.92,40.01 35.56,40.64 v40.64,40.64 | 41.59,46.35 v42.55,46.35 | 56.52,36.2 IC3.8 | 56.52,36.2 45.09,36.2 v40.64,40.64 | v40.64,20.32 v40.64,40.64 | IC3.7 57.78,36.83 57.15,36.2 56.52,36.2
  other vias: 53.34,32.38 67.31,48.26 67.31,44.45
  pour Bottom (isolate 0.61): 81.28,0 0,0 0,81.28 81.28,81.28
  pour Top (isolate 0.61): 81.28,0 0,0 0,81.28 81.28,81.28
ISP_PDO  (via drill 0.61 pad 1.27)
  Top 0.406: IC5.3 33.77,44.97 34.92,43.81 v34.92,38.1
  Bottom 0.406: X5.4 34.94,34.28 34.29,34.92 34.29,37.47 v34.92,38.1
ISP_RST  (via drill 0.61 pad 1.27)
  Top 0.406: C27.1 30.8,30.8 31.11,31.11 R22.1 35.88,30.8 37.1,32.02 IC5.20 37.1,35.93 v36.83,36.2
  Bottom 0.406: X5.2 37.44,35.59 v36.83,36.2
ISP_SCK  (via drill 0.61 pad 1.27)
  Top 0.406: IC5.11 31.05,38.67 30.48,38.1 v30.48,36.83
  Bottom 0.406: X5.5 33.69,33.62 v30.48,36.83
LED_CANSTATE  (via drill 0.61 pad 1.27)
  Top 0.406: IC5.16 32.19,34.73 31.75,34.29 v31.75,33.66 | v30.48,20.32 30.48,17.14 31.11,16.51 33.66,16.51 34.07,16.93 LED2.A
  Bottom 0.406: v31.75,33.66 32.38,33.02 32.38,23.5 30.48,21.59 v30.48,20.32
MUX0_A  (via drill 0.61 pad 1.27)
  Top 0.406: IC5.5 28.16,43.4 26.67,41.91 v26.67,33.02
  Bottom 0.406: IC4.11 22.23,34.92 24.13,33.02 26.04,33.02 v26.67,33.02
MUX0_B  (via drill 0.61 pad 1.27)
  Top 0.406: IC5.6 29.27,42.61 27.94,41.27 v27.94,34.29
  Bottom 0.406: IC4.10 23.5,35.56 24.77,34.29 27.3,34.29 v27.94,34.29
MUX0_C  (via drill 0.61 pad 1.27)
  Top 0.406: IC5.7 30.39,41.82 29.21,40.64 v29.21,35.56
  Bottom 0.406: IC4.9 24.77,36.2 25.4,35.56 28.57,35.56 v29.21,35.56
MUX0_INH  (via drill 0.61 pad 1.27)
  Top 0.406: IC5.4 28.84,44.18 26.67,46.35 v23.5,46.35
  Bottom 0.406: R3.1 14.61,41.91 15.24,41.27 21.59,41.27 22.23,41.91 IC4.6 22.23,45.09 v23.5,46.35
MUX1_A  (via drill 0.61 pad 1.27)
  Top 0.406: IC5.48 49.09,46.55 v50.16,47.62
  Bottom 0.406: v50.16,47.62 57.15,47.62 59.05,45.72 IC3.11
MUX1_B  (via drill 0.61 pad 1.27)
  Top 0.406: IC5.47 50.84,45.76 v51.44,46.35
  Bottom 0.406: v51.44,46.35 56.52,46.35 57.78,45.09 IC3.10
MUX1_C  (via drill 0.61 pad 1.27)
  Top 0.406: IC5.46 52.59,44.97 v52.7,45.09
  Bottom 0.406: IC3.9 56.52,44.45 55.88,45.09 53.34,45.09 v52.7,45.09
MUX1_INH  (via drill 0.61 pad 1.27)
  Top 0.406: IC5.45 51.07,44.18 v51.44,43.81
  Bottom 0.406: v51.44,43.81 51.44,41.91 52.7,40.64 59.05,40.64 | 59.05,40.64 IC3.6 | R25.1 66.67,39.37 65.41,40.64 59.05,40.64
N$1  (via drill 0.61 pad 1.27)
  Top 0.406: v14.61,57.15 18.41,57.15 24.77,50.8 R1.1
  Bottom 0.406: IC4.3 18.41,48.26 14.61,52.07 v14.61,57.15
N$2
  Top 0.406: R2.2 48.26,2.86 LED3.A
N$3
  Top 0.406: R26.2 78.42,48.26 LED4.A
N$4
  Top 0.406: R27.2 33.02,78.42 LED5.A
N$6
  Top 0.406: R28.2 2.86,33.02 LED6.A
N$7
  Top 0.406: 61.93,8.57 61.91,8.57 | R29.2 61.93,8.57 | LED7.A 62.14,8.57 61.93,8.57
N$8
  Top 0.406: J1.8 43.18,56.52 31.11,56.52 29.84,57.78 29.84,60.33 31.11,61.59 33.66,61.59 34.92,62.87 39.37,62.87 40.64,64.14 R21.1
N$9
  Top 0.406: R4.1 55.24,11.11 C10.1 57.15,7.62 TSOP00.VCC
N$10
  Top 0.406: TSOP01.VCC 73.66,57.15 C11.1 70.17,55.24 R5.1
N$11
  Top 0.406: R6.1 26.04,70.17 C12.1 24.13,73.66 TSOP02.VCC
N$12
  Top 0.406: R7.1 11.11,26.04 C13.1 7.62,24.13 TSOP03.VCC
N$13
  Top 0.406: C32.1 44.45,20.32 45.47,21.34 Q2.2 41.91,24.13 40.25,25.79 IC5.24
N$14
  Top 0.406: C31.1 36.83,20.32 35.81,21.34 Q2.1 38.1,24.13 39.46,25.49 IC5.23
N$15
  Top 0.406: R23.2 43.18,14.61 43.4,14.82 LED1.C
N$16
  Top 0.406: 72.71,61.93 72.71,61.91 | R30.2 72.71,61.93 | LED8.A 72.71,62.14 72.71,61.93
N$17
  Top 0.406: R24.2 38.1,14.61 37.88,14.82 LED2.C
N$18
  Top 0.406: 19.35,72.71 19.37,72.71 | 19.35,72.71 R31.2 | LED9.A 19.14,72.71 19.35,72.71
N$19
  Top 0.406: 8.57,19.35 8.57,19.37 | R32.2 8.57,19.35 | LED10.A 8.57,19.14 8.57,19.35
N$20
  Top 0.406: R33.2 72.71,19.05 LED11.A
N$21
  Top 0.406: TSOP04.VCC 68.26,16.51 C14.1 65.69,18.73 | 65.69,18.73 65.72,18.73 | 65.69,18.73 R8.1 | 65.69,18.73
N$22
  Top 0.406: TSOP05.VCC 64.77,68.26 C15.1 62.55,65.69 | R9.1 62.55,65.69 | 62.55,65.69 62.55,65.72
N$23
  Top 0.406: TSOP06.VCC 13.02,64.77 C16.1 15.85,62.55 15.88,62.55 15.88,62.27 R10.1
N$24
  Top 0.406: R34.2 62.23,72.71 LED12.A
N$26
  Top 0.406: R35.2 8.57,62.23 LED13.A
N$27
  Top 0.406: R36.2 19.05,8.57 LED14.A
N$28
  Top 0.406: R37.2 78.52,33.12 LED15.A
N$29
  Top 0.406: R38.2 48.16,78.52 LED16.A
N$30
  Top 0.406: R39.2 2.76,48.16 LED17.A
N$31
  Top 0.406: R40.2 33.12,2.76 LED18.A
N$32
  Top 0.406: TSOP07.VCC 16.51,13.02 C17.1 19.01,15.88 19.05,15.88 19.05,15.91 R11.1
N$33
  Top 0.406: TSOP15.VCC 43.18,3.81 C25.1 42.86,7.93 42.86,7.94 R19.1
N$34
  Top 0.813: D4.A 57.79,50.16 57.15,50.8 45.09,62.87 41.91,62.87 41.27,62.23 41.27,60.33 40.64,59.69 40.01,59.05 J1.4
  Bottom 0.406: J1.4 40.01,59.05 41.27,60.33 J1.5
N$35
  Top 0.406: TSOP14.VCC 3.81,38.1 C24.1 R18.1
N$36
  Top 0.406: TSOP13.VCC 38.1,77.47 C23.1 38.42,73.34 R17.1
N$37
  Top 0.406: TSOP12.VCC 77.47,43.18 C22.1 73.34,42.86 R16.1
N$38
  Top 0.406: R15.1 30.16,9.53 C21.1 28.89,5.71 TSOP11.VCC
N$39
  Top 0.406: R13.1 51.12,71.75 C19.1 52.39,75.56 TSOP09.VCC
N$40
  Top 0.406: R14.1 9.53,51.12 C20.1 5.71,52.39 TSOP10.VCC
N$41
  Top 0.406: R12.1 71.75,30.16 C18.1 75.56,28.89 TSOP08.VCC
TSOP_00
  Top 0.406: TSOP00.OUT 52.15,5.63 52.07,5.71 51.99,5.64 LED3.C
  Bottom 0.406: TSOP00.OUT 52.43,7.98 63.5,19.05 63.5,26.67 60.33,29.84 IC3.5
TSOP_01
  Top 0.406: TSOP01.OUT 75.65,52.15 75.56,52.07 75.64,51.99 LED4.C
  Bottom 0.406: IC3.15 64.14,48.26 67.94,52.07 74.93,52.07 75.29,52.43 TSOP01.OUT
TSOP_02
  Top 0.406: TSOP02.OUT 29.13,75.65 29.21,75.56 29.29,75.64 LED5.C
  Bottom 0.406: IC4.5 20.95,49.53 19.05,51.44 19.05,63.5 29.21,73.66 29.21,74.93 28.85,75.29 TSOP02.OUT
TSOP_03
  Top 0.406: TSOP03.OUT 5.63,29.13 5.71,29.21 5.64,29.29 LED6.C
  Bottom 0.406: IC4.15 17.14,32.38 13.97,29.21 6.35,29.21 5.99,28.85 TSOP03.OUT
TSOP_04
  Top 0.406: TSOP04.OUT 64.82,12.7 63.3,12.7 LED7.C
  Bottom 0.406: IC3.4 61.59,30.48 64.77,27.3 64.77,18.41 63.5,17.14 63.5,14.24 TSOP04.OUT
TSOP_05
  Top 0.406: TSOP05.OUT 68.58,64.82 68.58,63.3 LED8.C
  Bottom 0.406: IC3.14 62.87,48.9 68.58,54.61 68.58,64.77 68.47,64.88 TSOP05.OUT
TSOP_06
  Top 0.406: TSOP06.OUT 16.46,68.58 17.98,68.58 LED9.C
  Bottom 0.406: IC4.4 19.68,48.9 16.51,52.07 16.51,68.58 16.4,68.47 TSOP06.OUT
TSOP_07
  Top 0.406: TSOP07.OUT 12.7,16.46 12.7,17.98 LED10.C
  Bottom 0.406: IC4.14 18.41,31.75 12.7,26.04 12.7,16.51 12.81,16.4 TSOP07.OUT
TSOP_08
  Top 0.406: TSOP08.OUT 73.73,24.2 71.78,22.25 LED11.C
  Bottom 0.406: IC3.2 64.14,33.66 73.56,24.23 TSOP08.OUT
TSOP_09
  Top 0.406: TSOP09.OUT 57.08,73.73 59.03,71.78 LED12.C
  Bottom 0.406: IC3.13 61.59,49.53 65.41,53.34 65.41,62.87 60.96,67.31 60.96,69.85 57.08,73.73 TSOP09.OUT
TSOP_10
  Top 0.406: TSOP10.OUT 7.55,57.08 9.5,59.03 LED13.C
  Bottom 0.406: IC4.2 17.14,47.62 7.62,57.15 7.55,57.08 TSOP10.OUT
TSOP_11
  Top 0.406: TSOP11.OUT 24.2,7.55 22.25,9.5 LED14.C
  Bottom 0.406: IC4.13 19.68,31.11 16.51,27.94 16.51,17.78 24.13,10.16 24.13,7.62 24.2,7.55 TSOP11.OUT
TSOP_12
  Top 0.406: TSOP12.OUT 77.5,38.13 76.42,37.05 LED15.C
  Bottom 0.406: IC3.1 65.41,36.2 66.04,35.56 74.93,35.56 77.5,38.13 TSOP12.OUT
TSOP_13
  Top 0.406: TSOP13.OUT 43.15,77.5 44.23,76.42 LED16.C
  Bottom 0.406: IC3.12 60.33,50.16 64.14,53.98 64.14,62.23 60.33,66.04 54.61,66.04 43.15,77.5 TSOP13.OUT
TSOP_14
  Top 0.406: TSOP14.OUT 3.78,43.15 4.86,44.23 LED17.C
  Bottom 0.406: IC4.1 15.88,45.09 15.24,45.72 6.35,45.72 3.78,43.15 TSOP14.OUT
TSOP_15
  Top 0.406: TSOP15.OUT 38.13,3.78 37.05,4.86 LED18.C
  Bottom 0.406: IC4.12 20.95,30.48 19.05,28.57 19.05,19.68 34.92,3.81 38.1,3.81 38.13,3.78 TSOP15.OUT
UART0_RX  (via drill 0.61 pad 1.27)
  Top 0.406: v36.2,39.37 36.2,43.81 34.25,45.76 IC5.2 30.44,45.76 28.89,47.31 R1.2
  Bottom 0.406: X5.3 36.19,34.94 35.56,35.56 35.56,36.83 36.2,37.47 v36.2,39.37
UART1_RX  (via drill 0.61 pad 1.27)
  Top 0.406: IC5.27 42.61,30.42 44.45,28.57 v50.16,28.57 59.05,28.57 v62.87,32.38
  Bottom 0.406: X4.2 50.16,26.02 v50.16,28.57 | v62.87,32.38 IC3.3
UART1_TX  (via drill 0.61 pad 1.27)
  Top 0.406: IC5.28 43.4,30.9 44.45,29.84 v48.9,29.84
  Bottom 0.406: X4.3 v48.91,29.84 v48.9,29.84

### Text on the board
Top: Club Comet 2009 | Récepteur de balise